# EAGLE design CATv1 (EAGLE 7.7.0)
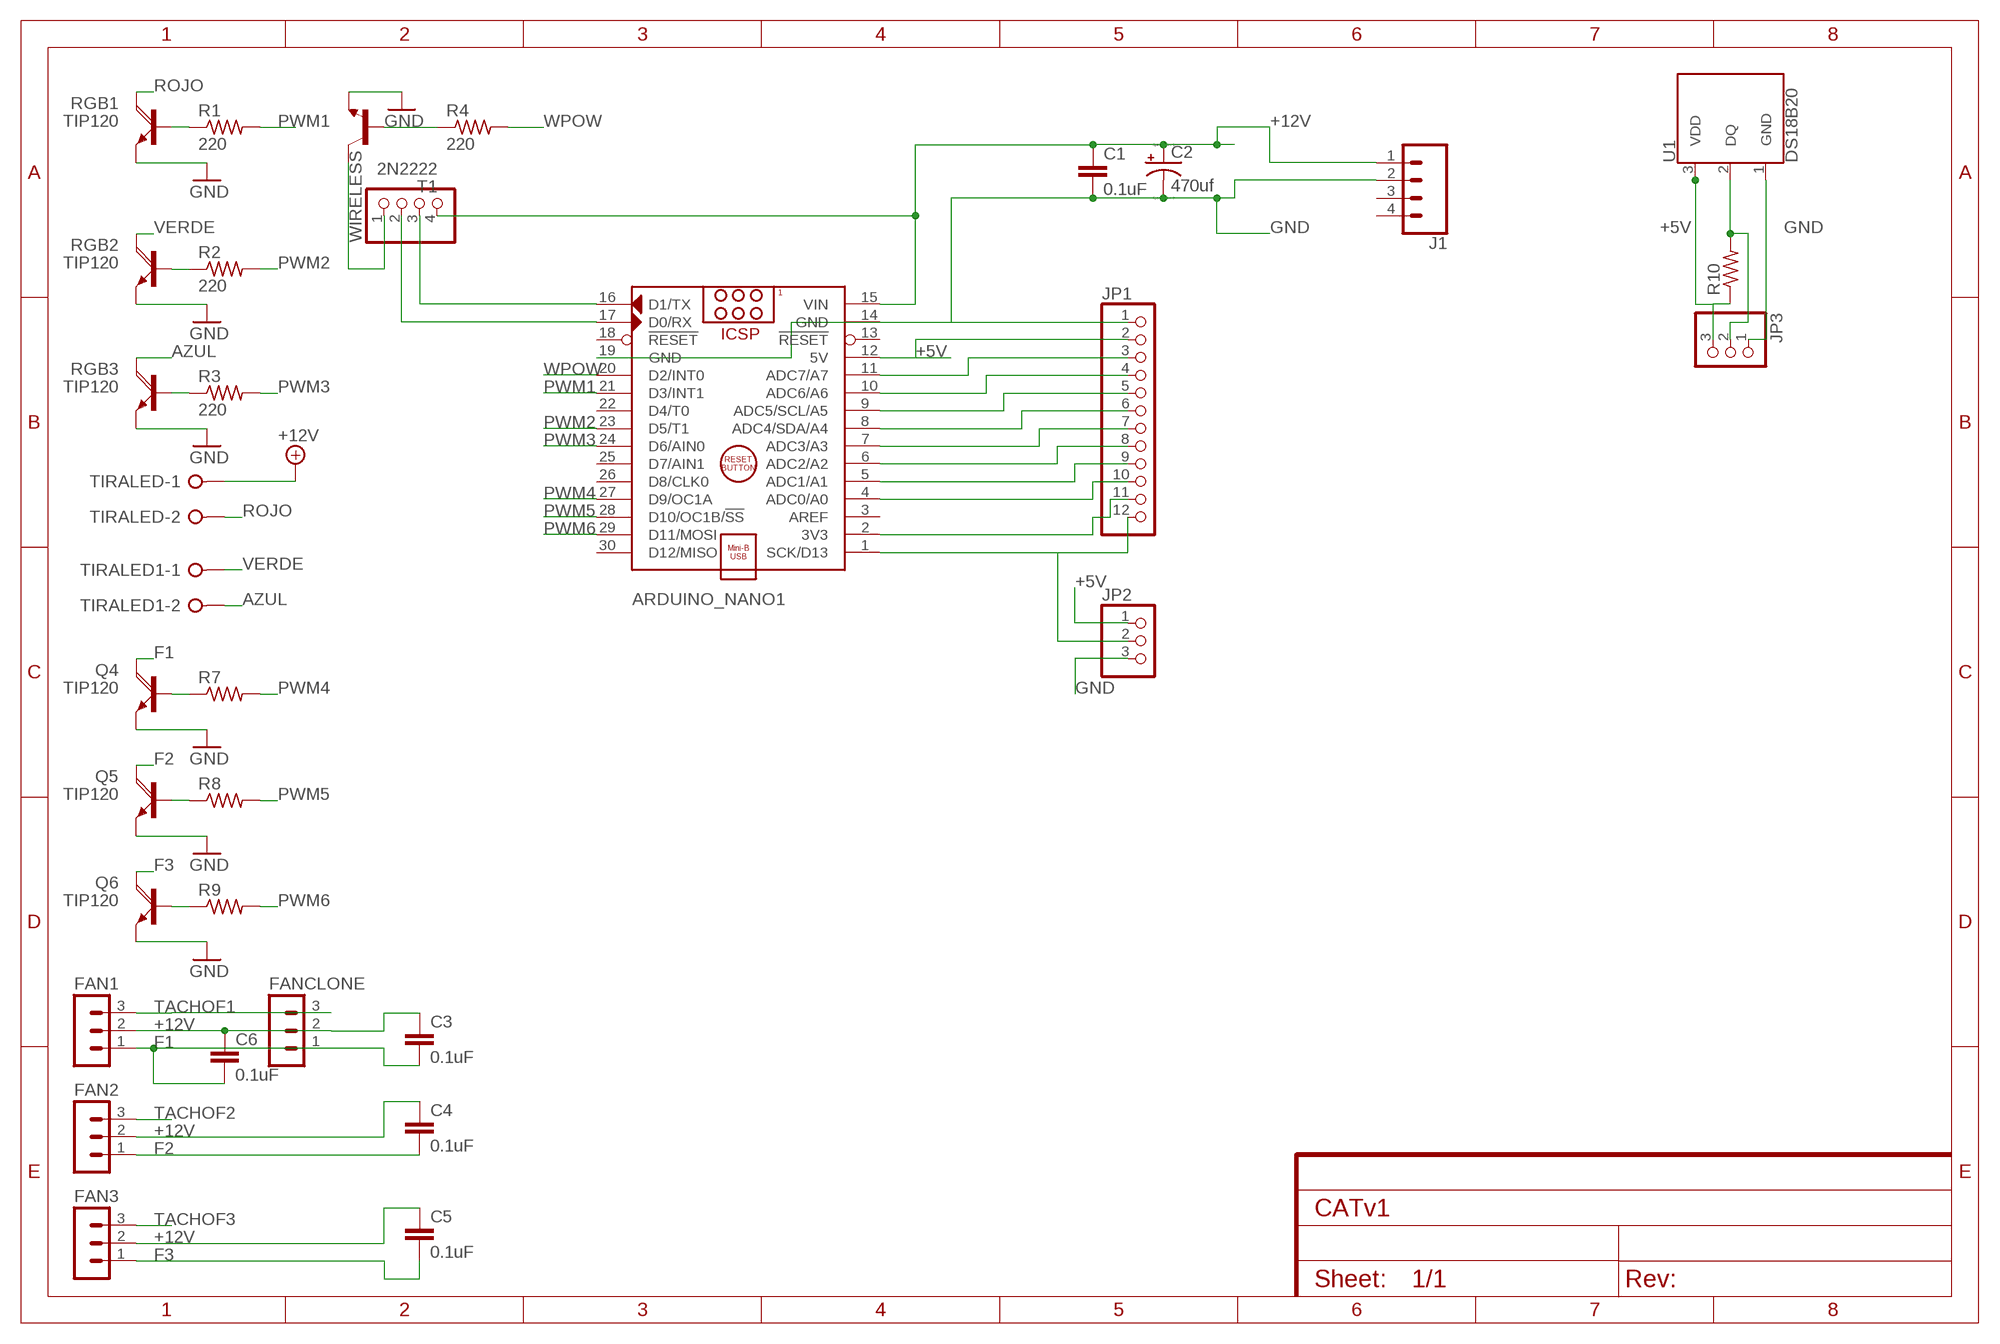
[diagram p0: schematic, sheet 1]

## Parts
ARDUINO_NANO1  ARDUINO_NANO  [ARDUINO_NANO]
C1  0.1uF  0.1UF-KIT-EZ-50V-20%  [CAP-PTH-SMALL-KIT]
C2  470uf  CPOL-USE5-10.5  [E5-10,5]
C3  0.1uF  0.1UF-KIT-EZ-50V-20%  [CAP-PTH-SMALL-KIT]
C4  0.1uF  0.1UF-KIT-EZ-50V-20%  [CAP-PTH-SMALL-KIT]
C5  0.1uF  0.1UF-KIT-EZ-50V-20%  [CAP-PTH-SMALL-KIT]
C6  0.1uF  0.1UF-KIT-EZ-50V-20%  [CAP-PTH-SMALL-KIT]
FAN1  MA03-1  [MA03-1]
FAN2  MA03-1  [MA03-1]
FAN3  MA03-1  [MA03-1]
FANCLONE  MA03-1  [MA03-1]
J1  CONN_04POLAR  [MOLEX-1X4]
JP1  PINHD-1X12  [1X12]
JP2  PINHD-1X3  [1X03]
JP3  PINHD-1X3  [1X03]
Q4  TIP120  [TO220AH]
Q5  TIP120  [TO220AH]
Q6  TIP120  [TO220AH]
R1  220  R-US_0207/10  [0207/10]
R2  220  R-US_0207/10  [0207/10]
R3  220  R-US_0207/10  [0207/10]
R4  220  R-US_0207/12  [0207/12]
R7  R-US_0207/10  [0207/10]
R8  R-US_0207/10  [0207/10]
R9  R-US_0207/10  [0207/10]
R10  R-US_0207/10  [0207/10]
RGB1  TIP120  [TO220AH]
RGB2  TIP120  [TO220AH]
RGB3  TIP120  [TO220AH]
T1  2N2222  [TO92-EBC-OVAL]
TIRALED  W237-02P  [W237-132]
TIRALED1  W237-02P  [W237-132]
U1  DS18B20  [TO-92-AMMO]
WIRELESS  PINHD-1X4  [1X04]

## Nets
+5V: ARDUINO_NANO1.12(5V) JP1.2 JP2.1 JP3.3 R10.1 U1.3(VDD)
+12V: ARDUINO_NANO1.15(VIN) C1.1 C2.+ C3.1 C4.1 C5.1 C6.1 FAN1.2 FAN2.2 FAN3.2 FANCLONE.2 J1.1 TIRALED.1 WIRELESS.4
AZUL: RGB3.C TIRALED1.2
F1: C3.2 C6.2 FAN1.1 FANCLONE.1 Q4.C
F2: C4.2 FAN2.1 Q5.C
F3: C5.2 FAN3.1 Q6.C
GND: ARDUINO_NANO1.14(GND) ARDUINO_NANO1.19(GND) C1.2 C2.- J1.2 JP1.1 JP2.3 JP3.1 Q4.E Q5.E Q6.E RGB1.E RGB2.E RGB3.E T1.E U1.1(GND)
N$1: ARDUINO_NANO1.16(D1/TX) WIRELESS.3
N$2: ARDUINO_NANO1.17(D0/RX) WIRELESS.2
N$4: R1.1 RGB1.B
N$5: R2.1 RGB2.B
N$6: R3.1 RGB3.B
N$7: JP3.2 R10.2 U1.2(DQ)
N$8: ARDUINO_NANO1.2(3V3) JP1.11
N$9: ARDUINO_NANO1.11(ADC7/A7) JP1.3
N$10: ARDUINO_NANO1.10(ADC6/A6) JP1.4
N$11: ARDUINO_NANO1.9(ADC5/SCL/A5) JP1.5
N$12: ARDUINO_NANO1.1(SCK/D13) JP1.12 JP2.2
N$13: ARDUINO_NANO1.8(ADC4/SDA/A4) JP1.6
N$14: ARDUINO_NANO1.7(ADC3/A3) JP1.7
N$15: ARDUINO_NANO1.6(ADC2/A2) JP1.8
N$17: Q4.B R7.1
N$18: Q5.B R8.1
N$19: Q6.B R9.1
N$20: ARDUINO_NANO1.5(ADC1/A1) JP1.9
N$21: ARDUINO_NANO1.4(ADC0/A0) JP1.10
N$27: R4.1 T1.B
N$29: T1.C WIRELESS.1
PWM1: ARDUINO_NANO1.21(D3/INT1) R1.2
PWM2: ARDUINO_NANO1.23(D5/T1) R2.2
PWM3: ARDUINO_NANO1.24(D6/AIN0) R3.2
PWM4: ARDUINO_NANO1.27(D9/OC1A) R7.2
PWM5: ARDUINO_NANO1.28(D10/OC1B/!SS) R8.2
PWM6: ARDUINO_NANO1.29(D11/MOSI) R9.2
ROJO: RGB1.C TIRALED.2
TACHOF1: FAN1.3 FANCLONE.3
TACHOF2: FAN2.3
TACHOF3: FAN3.3
VERDE: RGB2.C TIRALED1.1
WPOW: ARDUINO_NANO1.20(D2/INT0) R4.2
Unconnected: ARDUINO_NANO1.3(AREF) ARDUINO_NANO1.13(!RESET) ARDUINO_NANO1.18(!RESET) ARDUINO_NANO1.22(D4/T0) ARDUINO_NANO1.25(D7/AIN1) ARDUINO_NANO1.26(D8/CLK0) ARDUINO_NANO1.30(D12/MISO) J1.3 J1.4

## Library data of the parts
ARDUINO_NANO1 = ArduinoNanoV30:ARDUINO_NANO: Arduino Nano V3.0 Module Overview: The Arduino Nano is a small, complete, and breadboard-friendly board based on the ATmega328 (Arduino Nano 3.x) or ATmega168 (Arduino Nano 2.x). It has more or less the same functionality of the Arduino Duemilanove, but in a different package. It lacks only a DC power jack, and works with a Mini-B USB cable instead of a standard one. The Nano was designed and is being produced by Gravitech <http://www.gravitech.us/arna30wiatp.html>. General specifications: Item Value Microcontroller Atmel ATmega168 or ATmega328 Operating Voltage (logic level) 5 V Input Voltage (recommended) 7-12 V Input Voltage (limits) 6-20 V Digital I/O Pins 14 (of which 6 provide PWM output) Analog Input Pins 8 DC Current per I/O Pin 40 mA Flash Memory 16 KB (ATmega168) or 32 KB (ATmega328) of which 2 KB used by bootloader SRAM 1 KB (ATmega168) or 2 KB (ATmega328) EEPROM 512 bytes (ATmega168) or 1 KB (ATmega328) Clock Speed 16 MHz Dimensions (Inches) 0.73" x 1.70" Dimensions (mm) 18mm x 45mm Overall height About 9 mm (not including pins) Weigth 5 g Power: The Arduino Nano can be powered via the Mini-B USB connection, 6-20V unregulated external power supply (pin 30), or 5V regulated external power supply (pin 27). The power source is automatically selected to the highest voltage source. Memory: The ATmega168 has 16 KB of flash memory for storing code (of which 2 KB is used for the bootloader); the ATmega328 has 32 KB, (also with 2 KB used for the bootloader). The ATmega168 has 1 KB of SRAM and 512 bytes of EEPROM (which can be read and written with the EEPROM library); the ATmega328 has 2 KB of SRAM and 1 KB of EEPROM. Input and Output: Each of the 14 digital pins on the Nano can be used as an input or output, using pinMode(), digitalWrite(), and digitalRead() functions. They operate at 5 volts. Each pin can provide or receive a maximum of 40 mA and has an internal pull-up resistor (disconnected by default) of 20-50 kOhms. In addition, some pins have specialized functions. Visit Arduino - ArduinoBoardNano <https://www.arduino.cc/en/Main/ArduinoBoardNano>
C1 C3-C6 = SparkFun-Capacitors:0.1UF: 0.1µF ceramic capacitors A capacitor is a passive two-terminal electrical component used to store electrical energy temporarily in an electric field.; PROD_ID: CAP-08370
C2 = resistor:CPOL-US: POLARIZED CAPACITOR, American symbol
FAN1-FAN3 FANCLONE = con-lstb:MA03-1: PIN HEADER; OC_FARNELL: unknown; OC_NEWARK: unknown
J1 = SparkFun-Connectors:CONN_04: Multi connection point. Often used as Generic Header-pin footprint for 0.1 inch spaced/style header connections On any of the 0.1 inch spaced packages, you can populate with these: Break Away Headers - Straight <https://www.sparkfun.com/products/116> (PRT-00116) Break Away Male Headers - Right Angle <https://www.sparkfun.com/products/553> (PRT-00553) Female Headers <https://www.sparkfun.com/products/115> (PRT-00115) Break Away Headers - Machine Pin <https://www.sparkfun.com/products/117> (PRT-00117) Break Away Female Headers - Swiss Machine Pin <https://www.sparkfun.com/products/743> (PRT-00743) For SCREWTERMINALS and SPRING TERMINALS visit here: Screw Terimnals on SparkFun.com <https://www.sparkfun.com/search/results?term=Screw+Terminals> (5mm/3.5mm/2.54mm spacing) This device is also useful as a general connection point to wire up your design to another part of your project. Our various solder wires solder well into these plated through hole pads. Hook-Up Wire - Assortment (Stranded, 22 AWG) <https://www.sparkfun.com/products/11375> (PRT-11375) Hook-Up Wire - Assortment (Solid Core, 22 AWG) <https://www.sparkfun.com/products/11367> (PRT-11367) View the entire wire category on our website here <https://www.sparkfun.com/categories/141> Special notes: Molex polarized connector foot print use with SKU : PRT-08231 with associated crimp pins and housings. 1MM SMD Version SKU: PRT-10208; PROD_ID: CONN-08186; SF_ID: PRT-08231
JP1 = pinhead:PINHD-1X12: PIN HEADER
JP2 JP3 = pinhead:PINHD-1X3: PIN HEADER
Q4-Q6 RGB1-RGB3 = transistor-power:TIP120: NPN DARLINGTON TRANSISTOR
R1-R4 R7-R10 = adafruit:R-US_: RESISTOR, American symbol
T1 = adafruit:2N2222: NPN TRANSISTOR Big oval pads
TIRALED TIRALED1 = con-wago-508:W237-02P: WAGO SREW CLAMP; OC_FARNELL: unknown; OC_NEWARK: unknown
U1 = SparkFun-Sensors:DS18B20: Dallas/Maxim DS18B20 1-Wire Temperature Sensor The DS18B20 reports degrees C with 9 to 12-bit precision, -55C to 125C (+/-0.5C). Each sensor has a unique 64-Bit Serial number etched into it - allows for a huge number of sensors to be used on one data bus. Datasheet <http://datasheets.maximintegrated.com/en/ds/DS18B20.pdf> SparkFun Products One Wire Digital Temperature Sensor - DS18B20 <https://www.sparkfun.com/products/245> (SEN-00245); STORE_ID: SEN-00245
WIRELESS = pinhead:PINHD-1X4: PIN HEADER

## Board
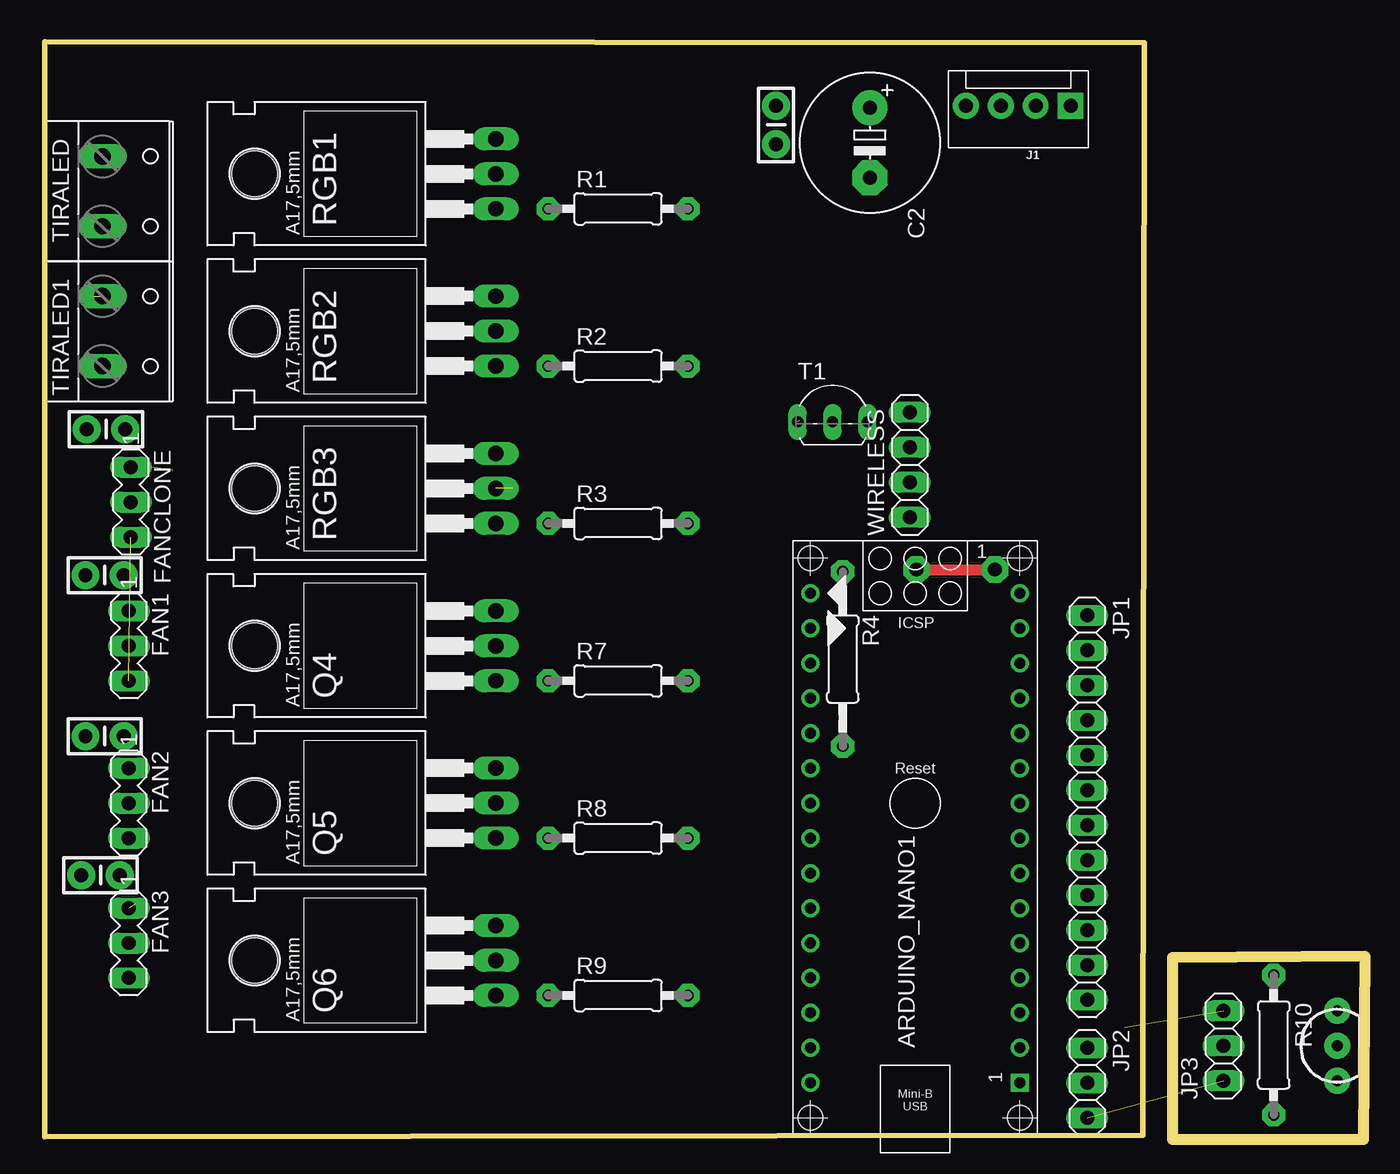
[diagram p1: board, top side]
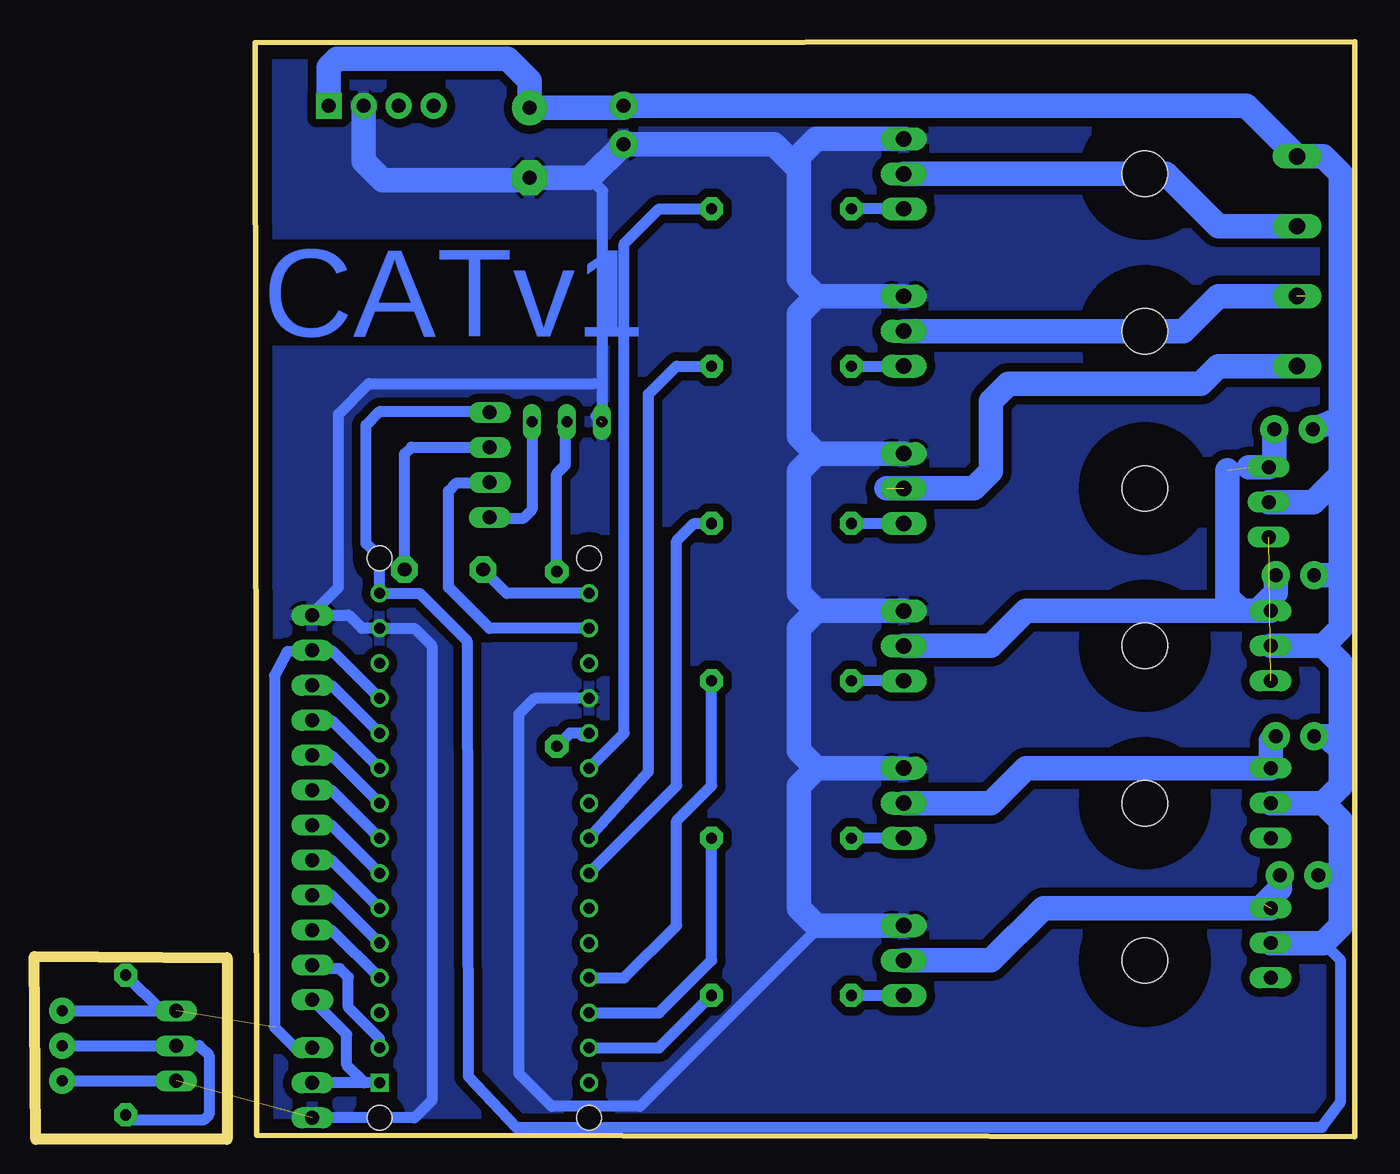
[diagram p2: board, bottom side, seen from below]

Size 95.97 x 79.76 mm. Coordinates in mm from the lower left corner, seen from the top.
Outline: 79.81,0.3 79.91,79.66 0,79.76 0,0.2 79.81,0.3
Outline: 81.97,0 95.87,0 95.97,13.3 81.97,13.2 81.97,0
Copper layers (1*16): Top 0.035mm / dielectric 1.5mm / Bottom 0.035mm
Design rules "default": minimum track width 10mil, minimum drill 24mil, track to track 8mil, track to pad 8mil, pad to pad 8mil, via to via 8mil, smd to smd 8mil, copper to edge 40mil, drill to drill 8mil, minimum pad ring 10mil, minimum via ring 8mil, stop-mask expansion 4mil, vias tented up to drill 0mil, thermal gap 10mil

### Footprints (pad centres in the part's own frame; a part is rotated, then mirrored left to right if it is on the bottom)
ARDUINO_NANO = drill 0.8 square: 1 -20.32,-7.62 | drill 0.8: 2 -17.78,-7.62; 3 -15.24,-7.62; 4 -12.7,-7.62; 5 -10.16,-7.62; 6 -7.62,-7.62; 7 -5.08,-7.62; 8 -2.54,-7.62; 9 0,-7.62; 10 2.54,-7.62; 11 5.08,-7.62; 12 7.62,-7.62; 13 10.16,-7.62; 14 12.7,-7.62; 15 15.24,-7.62; 16 15.24,7.62; 17 12.7,7.62; 18 10.16,7.62; 19 7.62,7.62; 20 5.08,7.62; 21 2.54,7.62; 22 0,7.62; 23 -2.54,7.62; 24 -5.08,7.62; 25 -7.62,7.62; 26 -10.16,7.62; 27 -12.7,7.62; 28 -15.24,7.62; 29 -17.78,7.62; 30 -20.32,7.62 | hole 1.778: -22.86,-7.62; -22.86,7.62; 17.78,7.62; 17.78,-7.62
CAP-PTH-SMALL-KIT = drill 1.016 pad 2.032: 1 -1.397,0; 2 1.397,0
E5-10,5 = drill 1.016 pad 2.54: + -2.54,0 | drill 1.016 pad 2.54 octagon: - 2.54,0
MA03-1 = drill 1.016 long: 1 -2.54,0; 2 0,0; 3 2.54,0
MOLEX-1X4 = drill 1.016 pad 1.88 square: 1 0,0 | drill 1.016 pad 1.88: 2 2.54,0; 3 5.08,0; 4 7.62,0
1X12 = drill 1.016 long: 1 -13.97,0; 2 -11.43,0; 3 -8.89,0; 4 -6.35,0; 5 -3.81,0; 6 -1.27,0; 7 1.27,0; 8 3.81,0; 9 6.35,0; 10 8.89,0; 11 11.43,0; 12 13.97,0
1X03 = drill 1.016 long: 1 -2.54,0; 2 0,0; 3 2.54,0
TO220AH = drill 1.118 long: B -2.54,-6.35; C 0,-6.35; E 2.54,-6.35 | hole 3.302: 0,11.176
0207/10 = drill 0.813 pad 1.676 octagon: 1 -5.08,0; 2 5.08,0
0207/12 = drill 0.813 pad 1.676 octagon: 1 -6.35,0; 2 6.35,0
TO92-EBC-OVAL = drill 0.813 long: B 0,-1.27; C 2.54,-1.27; E -2.54,-1.27
W237-132 = drill 1.194 long: 1 -2.54,-0.635; 2 2.54,-0.635
TO-92-AMMO = drill 0.813 pad 1.88: 1 -2.54,0; 2 0,0; 3 2.54,0
1X04 = drill 1.016 long: 1 -3.81,0; 2 -1.27,0; 3 1.27,0; 4 3.81,0

### Placement (x,y rotation side)
ARDUINO_NANO1  63.27,24.43 90 top
C1  53.17,73.7 270 top
C2  59.97,72.4 270 top
C3  4.37,41 0 top
C4  4.37,29.3 0 top
C5  4.07,19.2 0 top
C6  4.47,51.6 0 top
FAN1  6.12,35.86 270 top
FAN2  6.12,24.43 270 top
FAN3  6.12,14.27 270 top
FANCLONE  6.27,46.3 270 top
J1  74.57,75.1 180 top
JP1  75.77,24.1 270 top
JP2  75.77,4.11 270 top
JP3  85.67,6.8 90 top
Q4  26.44,35.86 90 top
Q5  26.44,24.43 90 top
Q6  26.44,13 90 top
R1  41.68,67.61 0 top
R2  41.68,56.18 0 top
R3  41.68,44.75 0 top
R4  58.01,34.91 270 top
R7  41.68,33.32 0 top
R8  41.68,21.89 0 top
R9  41.68,10.46 0 top
R10  89.33,6.86 270 top
RGB1  26.44,70.15 90 top
RGB2  26.44,58.72 90 top
RGB3  26.44,47.29 90 top
T1  57.27,53.4 0 top
TIRALED  4.85,68.88 270 top
TIRALED1  4.85,58.72 270 top
U1  93.94,6.81 90 top
WIRELESS  62.88,49.01 90 top

### Tracks (layer width: path | path; a pad name or v marks a point on that pad's centre or on a via)
+5V  (1 unrouted)
  Bottom 0.813: JP2.1 77.01,6.65 78.51,8.15 78.51,33.72 77.6,35.43 JP1.2 74.37,35.53 ARDUINO_NANO1.12 | R10.1 86.73,9.34 JP3.3 U1.3
+12V
  Bottom 0.813: 2.31,14.27 1.04,13 1.04,2.74 2.41,0.87 60.96,0.87 64.44,4.58 64.54,36.24 67.97,39.67 ARDUINO_NANO1.15 70.89,42.32 71.87,43.3 71.87,51.9 70.87,52.9 62.96,52.9 WIRELESS.4
  Bottom 1.778: 2.31,35.86 1.04,34.59 1.04,28.3 | 1.04,28.3 1.04,25.7 2.31,24.43 | FAN3.2 2.31,14.27 1.04,15.54 1.04,19.5 | 1.04,19.5 1.04,23.16 2.31,24.43 | FAN1.2 2.31,35.86 | 2.31,35.86 1.04,37.13 1.04,40.8 | 1.04,40.8 1.04,48.3 | 1.04,48.3 1.04,51.4 | 1.04,51.4 1.04,70.15 2.31,71.42 TIRALED.1 7.89,75.1 C1.1 53.33,74.94 C2.+ 59.97,76.9 61.57,78.5 73.97,78.5 74.57,77.9 J1.1 | FANCLONE.2 3.04,46.3 1.04,48.3 | C6.1 1.74,52.1 1.04,51.4 | C5.1 1.34,19.2 1.04,19.5 | C4.1 2.04,29.3 1.04,28.3 | FAN2.2 2.31,24.43 | C3.1 1.24,41 1.04,40.8
AZUL  (1 unrouted)
  Bottom 1.778: TIRALED1.2 9.93,56.18 11.2,54.91 25.17,54.91 26.44,53.64 26.44,48.56 27.71,47.29 34.06,47.29
F1  (1 unrouted)
  Bottom 0.813: C6.2 5.77,51.5
  Bottom 1.778: FAN1.1 7.07,38.4 | 7.07,38.4 8.27,38.4 | 8.27,38.4 23.9,38.4 26.44,35.86 Q4.C | 7.73,48.84 FANCLONE.1 5.87,49.24 C6.2 | 9.27,48.6 9.27,39.4 8.27,38.4 | C3.2 5.77,39.7 7.07,38.4
F2
  Bottom 1.778: Q5.C 26.44,24.43 23.9,26.97 FAN2.1 6.12,28.95 C4.2
F3  (1 unrouted)
  Bottom 1.778: FAN3.1 22.63,16.81 26.44,13 Q6.C | C5.2 5.47,18.2 6.57,17.1
GND  (2 unrouted)
  Bottom 0.813: 73.1,38.07 72.16,37.13 ARDUINO_NANO1.14 68.35,37.13 67.08,35.86 67.08,2.84 68.35,1.57 JP2.3 | 73.1,38.07 73.23,38.1 | JP1.1 73.1,38.07 | U1.1 JP3.1 | 39.85,72.13 39.85,71.98 | 40.51,70.9 40.41,70.8 | Q6.E 38.83,15.54 51.97,2.4 58.37,2.4 60.77,4.8 60.77,30.9 59.62,32.05 ARDUINO_NANO1.19 | 55.17,52.57 T1.E | 75.67,38.3 73.87,40.1 73.87,52.7 71.67,54.9 55.27,54.9 | 54.87,52.2 54.67,52.4 54.67,68.92 55.61,69.86
  Bottom 1.778: Q4.E 39.14,38.4 | 39.14,38.4 40.41,39.67 40.41,48.56 39.14,49.83 | 39.14,49.83 RGB3.E | RGB2.E 39.14,61.26 | 39.14,61.26 40.41,59.99 40.41,51.1 39.14,49.83 | Q5.E 39.14,26.97 | 39.14,26.97 40.41,28.24 40.41,37.13 39.14,38.4 | Q6.E 39.14,15.54 40.41,16.81 40.41,25.7 39.14,26.97 | RGB1.E 39.14,72.69 39.85,71.98 40.41,71.42 40.41,70.8 40.41,70.5 | 40.41,70.5 40.41,62.53 39.14,61.26 | J1.2 72.03,71.06 70.67,69.7 60.13,69.7 C2.- 55.61,69.86 C1.2 42.21,72.3 40.41,70.5
  pour Bottom (isolate 0.61): 0.57,79.9 80.07,79.3 79.97,-0.1 0.17,-0.1 0.17,79.8
N$1  (via drill 1 pad 1.93)
  Top 0.813: v63.37,41.4 v69.07,41.4
  Bottom 0.813: v69.07,41.4 69.07,49.8 68.57,50.3 62.9,50.3 WIRELESS.3 | ARDUINO_NANO1.16 61.64,39.67 v63.37,41.4
N$2
  Bottom 0.813: ARDUINO_NANO1.17 62.9,37.13 65.87,40.1 65.87,47.1 65.27,47.7 62.92,47.7 WIRELESS.2
N$4
  Bottom 0.813: RGB1.B R1.1
N$5
  Bottom 0.813: R2.1 RGB2.B
N$6
  Bottom 0.813: R3.1 RGB3.B
N$7
  Bottom 0.813: JP3.2 U1.2 83.98,6.81 83.27,6.1 83.27,1.8 83.67,1.4 88.95,1.4 R10.2
N$8
  Bottom 0.813: ARDUINO_NANO1.2 70.89,7.32 73.17,9.6 73.17,11.8 73.77,12.4 75.5,12.4 JP1.11
N$9
  Bottom 0.813: JP1.3 74.37,32.99 ARDUINO_NANO1.11
N$10
  Bottom 0.813: JP1.4 74.37,30.45 ARDUINO_NANO1.10
N$11
  Bottom 0.813: JP1.5 74.37,27.91 ARDUINO_NANO1.9
N$12
  Bottom 0.813: JP2.2 ARDUINO_NANO1.1 71.98,4.11 73.27,5.4 73.27,7.63 JP1.12
N$13
  Bottom 0.813: JP1.6 74.37,25.37 ARDUINO_NANO1.8
N$14
  Bottom 0.813: JP1.7 74.37,22.83 ARDUINO_NANO1.7
N$15
  Bottom 0.813: JP1.8 74.37,20.29 ARDUINO_NANO1.6
N$17
  Bottom 0.813: Q4.B R7.1
N$18
  Bottom 0.813: Q5.B R8.1
N$19
  Bottom 0.813: R9.1 Q6.B
N$20
  Bottom 0.813: JP1.9 74.37,17.75 ARDUINO_NANO1.5
N$21
  Bottom 0.813: JP1.10 74.37,15.21 ARDUINO_NANO1.4
N$27
  Bottom 0.813: 57.61,51.79 T1.B 57.37,52.03 57.37,49 58.01,48.36 R4.1
N$29
  Bottom 0.813: T1.C 59.81,45.76 60.47,45.1 62.78,45.1 WIRELESS.1
N$30
  Bottom 0.813: 55.67,29.3 56.17,29.3
PWM1
  Bottom 0.813: ARDUINO_NANO1.21 53.11,29.51 53.11,65.07 50.57,67.61 R1.2
PWM2
  Bottom 0.813: ARDUINO_NANO1.23 51.34,26.7 51.34,54.14 49.3,56.18 R2.2
PWM3
  Bottom 0.813: ARDUINO_NANO1.24 49.3,25.7 49.3,43.48 48.03,44.75 R3.2
PWM4
  Bottom 0.813: ARDUINO_NANO1.27 53.11,11.73 49.3,15.54 49.3,23.16 46.76,25.7 R7.2
PWM5
  Bottom 0.813: ARDUINO_NANO1.28 50.57,9.19 46.76,13 R8.2
PWM6
  Bottom 0.813: ARDUINO_NANO1.29 50.57,6.65 R9.2
ROJO
  Bottom 1.778: RGB1.C 13.74,70.15 9.93,66.34 TIRALED.2
TACHOF1  (1 unrouted)
VERDE  (1 unrouted)
  Bottom 1.778: RGB2.C 12.47,58.72 9.93,61.26 3.58,61.26
WPOW
  Bottom 0.813: ARDUINO_NANO1.20 57.05,29.51 R4.2

### Text on the board
Bottom: CATv1